# Altium project ESC_Controller.PrjPcb
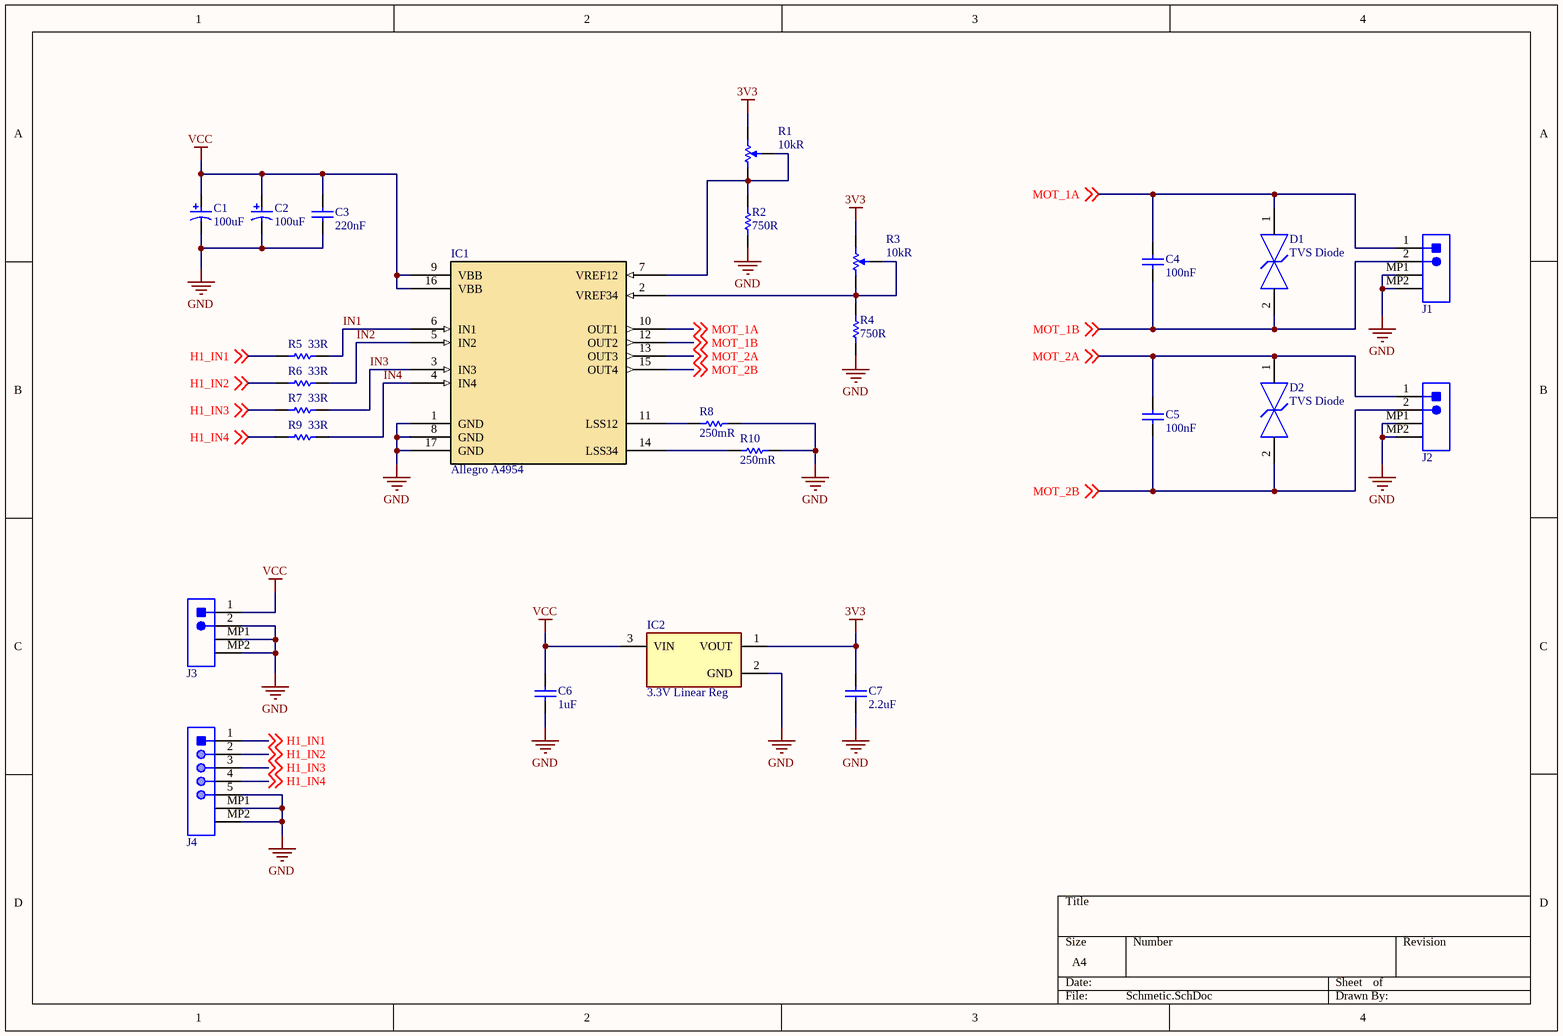
[diagram p0: Schmetic.SchDoc]
1 sheet, 25 parts. Net scope: global (net labels, ports and power ports of the same name join across sheets).
Board file: PCB.PcbDoc

## Sheet Schmetic.SchDoc
size A4

### Parts
C1  100uF  [NIC-UWT1H101MNL1GS_N]
C2  100uF  [NIC-UWT1H101MNL1GS_N]
C3  220nF  [CAPC1005X55N]
C4  100nF  [CAPC1005X60X30NL05T10]
C5  100nF  [CAPC1005X60X30NL05T10]
C6  1uF  [CAP_CL10_SAM]
C7  2.2uF  [CAPC1608X90N]
D1  TVS Diode  [FP-SMAJ-CA-MFG]
D2  TVS Diode  [FP-SMAJ-CA-MFG]
IC1  Allegro A4954  [TSSOP-16_ALM]
IC2  3.3V Linear Reg  [FP-SOT89-MFG]
J1  2 Pin Header  [JST-BM02B-GHS-TBT_V]  (value not drawn)
J2  2 Pin Header  [JST-BM02B-GHS-TBT_V]  (value not drawn)
J3  2 Pin Header  [JST-BM02B-GHS-TBT_V]  (value not drawn)
J4  5 Pin Header  [JST-BM05B-GHS-TBT_V]  (value not drawn)
R1  10kR  [BOUR-TC33X-2_V]
R2  750R  [RESC1005X40X25NL05T05]
R3  10kR  [BOUR-TC33X-2_V]
R4  750R  [RESC1005X40X25NL05T05]
R5  33R  [RESC1005X40X25NL05T05]
R6  33R  [RESC1005X40X25NL05T05]
R7  33R  [RESC1005X40X25NL05T05]
R8  250mR  [RESC3015X65N]
R9  33R  [RESC1005X40X25NL05T05]
R10  250mR  [RESC3015X65N]

### Nets
3V3: C7.2 IC2.1(VOUT) R1.3 R3.3
GND: C1.2 C2.2 C3.1 C6.1 C7.1 IC1.1(GND) IC1.8(GND) IC1.17(GND) IC2.2(GND) J1.MP1 J1.MP2 J2.MP1 J2.MP2 J3.2 J3.MP1 J3.MP2 J4.5 J4.MP1 J4.MP2 R2.1 R4.1 R8.2 R10.2
VCC: C1.1 C2.1 C3.2 C6.2 IC1.9(VBB) IC1.16(VBB) IC2.3(VIN) J3.1
H1_IN1: J4.1 R5.1 ; off-sheet H1_IN1
H1_IN2: J4.2 R6.1 ; off-sheet H1_IN2
H1_IN3: J4.3 R7.1 ; off-sheet H1_IN3
H1_IN4: J4.4 R9.1 ; off-sheet H1_IN4
IN1: IC1.6(IN1) R5.2
IN2: IC1.5(IN2) R6.2
IN3: IC1.3(IN3) R7.2
IN4: IC1.4(IN4) R9.2
MOT_1A: C4.2 D1.1 IC1.10(OUT1) J1.1 ; off-sheet MOT_1A
MOT_1B: C4.1 D1.2 IC1.12(OUT2) J1.2 ; off-sheet MOT_1B
MOT_2A: C5.1 D2.1 IC1.13(OUT3) J2.1 ; off-sheet MOT_2A
MOT_2B: C5.2 D2.2 IC1.15(OUT4) J2.2 ; off-sheet MOT_2B
NetIC1_2: IC1.2(VREF34) R3.1 R3.2 R4.2
NetIC1_7: IC1.7(VREF12) R1.1 R1.2 R2.2
NetIC1_11: IC1.11(LSS12) R8.1
NetIC1_14: IC1.14(LSS34) R10.1

### Library data of the parts
C1 C2 = 100uF: 100uF 50 V dc Aluminium Electrolytic Capacitor; WT Series 1000h 8 (Dia.) x 10mm; Manufacturer: Nichicon; Manufacturer Part Number: UWT1H101MNL1GS; Tolerance: 20%; Ripple Current: 140mA; Voltage Rating: 50V; Leakage Current: 3uA; Life (Hours): 1000Hour; Dissipation Factor: 0.14%; Supplier 1: Digi-Key; RoHS: Yes; Category: Aluminum Electrolytic Capacitors; Stock 1: 103638; Pricing 1: 1=0,44000, 10=0,31400, 50=0,23720, 100=0,20660 (USD); Mount: Surface Mount; Case/Package: Radial; Number of Pins: 2; Dielectric Material: Aluminium; Min Operating Temperature: -55°C; Max Operating Temperature: 105°C; Capacitance: 100uF; Package Quantity: 500; Packaging: Tape and Reel; Ripple Current (AC): 140mA; Voltage Rating (DC): 50V; Termination: SMD/SMT; Voltage: 50V; Diameter: 8mm; Length: 10mm; Height: 10mm; Height - Seated (Max): 0.413inch; Radiation Hardening: No; REACH SVHC: No SVHC; Lead Free: Lead Free; ComponentLink1URL: https://datasheet.ciiva.com/97/e-wt-97104.pdf?src-supplier=Digi-Key; ComponentLink1Description: https://datasheet.ciiva.com/97/e-wt-97104.pdf?src-supplier=Digi-Key; ComponentLink2URL: https://datasheet.ciiva.com/97/e-wt-97105.pdf?src-supplier=Digi-Key; ComponentLink2Description: https://datasheet.ciiva.com/97/e-wt-97105.pdf?src-supplier=Digi-Key; ComponentLink3URL: https://datasheet.ciiva.com/97/e-wt-97106.pdf?src-supplier=Digi-Key; ComponentLink3Description: https://datasheet.ciiva.com/97/e-wt-97106.pdf?src-supplier=Digi-Key; ComponentLink4URL: https://datasheet.ciiva.com/11776/0900766b80fa3a91-11776930.pdf?src-supplier=RSComponents; ComponentLink4Description: https://datasheet.ciiva.com/11776/0900766b80fa3a91-11776930.pdf?src-supplier=RSComponents; ComponentLink5URL: https://datasheet.ciiva.com/5362/e-wt-30307-5362773.pdf?src-supplier=Mouser; ComponentLink5Description: https://datasheet.ciiva.com/5362/e-wt-30307-5362773.pdf?src-supplier=Mouser; ComponentLink6URL: https://datasheet.ciiva.com/11686/e-wt-11686889.pdf?src-supplier=Avnet; ComponentLink6Description: https://datasheet.ciiva.com/11686/e-wt-11686889.pdf?src-supplier=Avnet; ComponentLink7URL: https://datasheet.ciiva.com/28458/1910938-28458459.pdf?src-supplier=Element14; ComponentLink7Description: https://datasheet.ciiva.com/28458/1910938-28458459.pdf?src-supplier=Element14; ComponentLink8URL: https://datasheet.ciiva.com/16502/e-wt-16502940.pdf?src-supplier=Future+Electronics; ComponentLink8Description: https://datasheet.ciiva.com/16502/e-wt-16502940.pdf?src-supplier=Future+Electronics; ComponentLink9URL: https://datasheet.ciiva.com/7781/e-wt-7781807.pdf?src-supplier=Element14; ComponentLink9Description: https://datasheet.ciiva.com/7781/e-wt-7781807.pdf?src-supplier=Element14; ComponentLink10URL: https://datasheet.ciiva.com/17527/e-wt-17527183.pdf?src-supplier=Avnet+Europe; ComponentLink10Description: https://datasheet.ciiva.com/17527/e-wt-17527183.pdf?src-supplier=Avnet+Europe; Supplier Part Number 1: 493-2226-1-ND
C3 = 220nF: TAIYO YUDEN - UMK105BJ224KV-F - CAPACITOR, MLCC, X5R, 0.22UF, 50V, 0402, FULL REEL; Tolerance: 10%; Supplier 1: Digi-Key; Manufacturer: Taiyo Yuden; Manufacturer Part Number: UMK105BJ224KV-F; RoHS: Yes; Category: Ceramic Capacitors; Stock 1: 285982; Pricing 1: 1=0,21000, 10=0,14400, 50=0,08660, 100=0,07320, 500=0,05006, 1000=0,04428, 2500=0,04235, 5000=0,03850 (USD); Mount: Surface Mount; Case/Package: 0402; Case Code (Metric): 1005; Case Code (Imperial): 0402; Min Operating Temperature: -55°C; Max Operating Temperature: 85°C; Termination: SMD/SMT; Package Quantity: 10000; Packaging: Tape and Reel; Capacitance: 220nF; Voltage Rating: 50V; Voltage Rating (DC): 50V; Dielectric: X5R; Length: 0.039inch; Height: 0.5mm; Thickness: 0.022inch; Width: 0.02inch; Lead Free: Lead Free; Halogen Free: Halogen Free; ComponentLink1URL: https://datasheet.ciiva.com/30112/713umk105bj224kv-f-30112478.pdf?src-supplier=Onlinecomponents.com; ComponentLink1Description: https://datasheet.ciiva.com/30112/713umk105bj224kv-f-30112478.pdf?src-supplier=Onlinecomponents.com; ComponentLink2URL: https://datasheet.ciiva.com/24495/460umk105bj224kv-f-24495779.pdf?src-supplier=Onlinecomponents.com; ComponentLink2Description: https://datasheet.ciiva.com/24495/460umk105bj224kv-f-24495779.pdf?src-supplier=Onlinecomponents.com; ComponentLink3URL: https://datasheet.ciiva.com/18697/mlcc-all-e-18697509.pdf?src-supplier=Digi-Key; ComponentLink3Description: https://datasheet.ciiva.com/18697/mlcc-all-e-18697509.pdf?src-supplier=Digi-Key; Supplier Part Number 1: 587-3500-1-ND
C4 C5 = 100nF: Capacitor 100 nF 10 VDC 0402 | KEMET C0402C104K8PACTU (Capacitor 100 nF 10 VDC 0402 Ceramic Capacitors).; Tolerance: 10%; Voltage Rating: 10V; Dielectric: X5R; Dissipation Factor: 5%; Supplier 1: Digi-Key; Manufacturer: KEMET; Manufacturer Part Number: C0402C104K8PACTU; RoHS: Yes; Category: Ceramic Capacitors; Stock 1: 907324; Pricing 1: 1=0,10000, 10=0,04000, 50=0,02180, 100=0,01780, 500=0,01270, 1000=0,00998, 2500=0,00908, 5000=0,00835 (USD); Mount: Surface Mount,PCB; Case/Package: 0402; Number of Pins: 2; Case Code (Metric): 1005; Case Code (Imperial): 0402; Contact Plating: Tin,Matte; Dielectric Material: Ceramic; Min Operating Temperature: -55°C; Max Operating Temperature: 85°C; Capacitance: 100nF; Voltage Rating (DC): 10V; Package Quantity: 1; Packaging: Tape and Reel; Termination: SMD/SMT; Voltage: 10V; Length: 1mm; Height: 0.5mm; Width: 0.02inch; Thickness: 0.022inch; Lead Pitch: 0.3mm; Depth: 0.5mm; Radiation Hardening: No; REACH SVHC: No SVHC; Lead Free: Lead Free; ComponentLink1URL: https://datasheet.ciiva.com/7747/1776086-7747440.pdf?src-supplier=Element14; ComponentLink1Description: https://datasheet.ciiva.com/7747/1776086-7747440.pdf?src-supplier=Element14; ComponentLink2URL: https://datasheet.ciiva.com/144/docfinderpartnumber-c0402c104k8pactu-144097.pdf?src-supplier=Digi-Key; ComponentLink2Description: https://datasheet.ciiva.com/144/docfinderpartnumber-c0402c104k8pactu-144097.pdf?src-supplier=Digi-Key; ComponentLink3URL: https://datasheet.ciiva.com/14595/70095383-14595064.pdf?src-supplier=Allied+Electronics; ComponentLink3Description: https://datasheet.ciiva.com/14595/70095383-14595064.pdf?src-supplier=Allied+Electronics; ComponentLink4URL: https://datasheet.ciiva.com/14588/70095383-14588187.pdf?src-supplier=Allied+Electronics; ComponentLink4Description: https://datasheet.ciiva.com/14588/70095383-14588187.pdf?src-supplier=Allied+Electronics; ComponentLink5URL: https://datasheet.ciiva.com/28645/1789732-28645387.pdf?src-supplier=Element14; ComponentLink5Description: https://datasheet.ciiva.com/28645/1789732-28645387.pdf?src-supplier=Element14; Supplier Part Number 1: 399-3027-1-ND
C6 = 1uF: Cap Ceramic 1uF 50V X5R 10% SMD 0603 85C Cardboard T/R; Manufacturer: Samsung; Manufacturer Part Number: CL10A105KB8NNNC; Supplier 1: Digi-Key; RoHS: Yes; Category: Ceramic Capacitors; Stock 1: 1724919; Pricing 1: 1=0,15000, 10=0,10500, 50=0,05960, 100=0,04940, 500=0,03462, 1000=0,02866 (USD); Mount: Surface Mount; Case/Package: 0603; Case Code (Imperial): 0603; Case Code (Metric): 1608; Contact Plating: Tin; Min Operating Temperature: -55°C; Max Operating Temperature: 85°C; Package Quantity: 1; Packaging: Tape and Reel; Capacitance: 1uF; Tolerance: 10%; Voltage Rating: 50V; Dielectric: X5R; Termination: Wraparound; Length: 1.6mm; Width: 0.031inch; Thickness: 0.035inch; Depth: 0.8mm; Radiation Hardening: No; ComponentLink1URL: https://datasheet.ciiva.com/26877/getdatasheetpartid-753736-26877879.pdf?src-supplier=Verical; ComponentLink1Description: https://datasheet.ciiva.com/26877/getdatasheetpartid-753736-26877879.pdf?src-supplier=Verical; Supplier Part Number 1: 1276-1860-1-ND
C7 = 2.2uF: SAMSUNG ELECTRO-MECHANICS - CL10A225KP8NNNC - SMD Multilayer Ceramic Capacitor, 2.2 µF, 10 V, 0603 [1608 Metric], ± 10%, X5R, CL Series; Voltage Rating: 10V; Supplier 1: Digi-Key; Manufacturer: Samsung; Manufacturer Part Number: CL10A225KP8NNNC; RoHS: Yes; Category: Ceramic Capacitors; Stock 1: 840059; Pricing 1: 1=0,10000, 10=0,05600, 50=0,03040, 100=0,02490, 500=0,01778, 1000=0,01398 (USD); Mount: Surface Mount; Case/Package: 0603; Case Code (Metric): 1608; Case Code (Imperial): 0603; Material: Ceramic; Min Operating Temperature: -55°C; Max Operating Temperature: 85°C; Tolerance: 10%; Capacitance: 2.2uF; Dielectric: X5R; Package Quantity: 1; Packaging: Tape and Reel; Voltage: 10V; Voltage Rating (DC): 10V; Length: 1.6mm; Height: 0.8mm; Width: 0.031inch; Thickness: 0.035inch; Depth: 0.8mm; Radiation Hardening: No; Lead Free: Lead Free; ComponentLink1URL: https://datasheet.ciiva.com/25799/cl10a225kp8nnnc-25799697.pdf?src-supplier=Digi-Key; ComponentLink1Description: https://datasheet.ciiva.com/25799/cl10a225kp8nnnc-25799697.pdf?src-supplier=Digi-Key; ComponentLink2URL: https://datasheet.ciiva.com/26838/getdatasheetpartid-358617-26838359.pdf?src-supplier=Verical; ComponentLink2Description: https://datasheet.ciiva.com/26838/getdatasheetpartid-358617-26838359.pdf?src-supplier=Verical; ComponentLink3URL: https://datasheet.ciiva.com/29198/457945-da-01-en-vs-kondensator-0603-29198592.pdf?src-supplier=Conrad; ComponentLink3Description: https://datasheet.ciiva.com/29198/457945-da-01-en-vs-kondensator-0603-29198592.pdf?src-supplier=Conrad; Supplier Part Number 1: 1276-1085-1-ND
D1 D2 = TVS Diode: LITTELFUSE - SMAJ36CA - TVS Diode, SMAJ Series, Bidirectional, 36 V, 58.1 V, DO-214AC (SMA), 2 Pins; Reverse Standoff Voltage: 36V; Clamping Voltage: 58.1V; Peak Pulse Current: 6.9A; Peak Pulse Power: 400W; Test Current: 1mA; Reverse Breakdown Voltage: 40V; Number of Elements: 1; Leakage Current: 1uA; Max Power Dissipation: 3.3W; Power Line Protection: No; Max Breakdown Voltage: 44.2V; Supplier 1: Digi-Key; Manufacturer: Littelfuse; Manufacturer Part Number: SMAJ36CA; RoHS: Yes; Category: TVS Diodes; Stock 1: 7566; Pricing 1: 1=0,41000, 10=0,27500, 100=0,15750, 500=0,11000, 1000=0,08750, 2000=0,08500 (USD); Mount: Surface Mount; Number of Pins: 2; Min Operating Temperature: -55°C; Max Operating Temperature: 150°C; Packaging: Tape and Reel; Polarity: Bidirectional; Breakdown Voltage: 40V; Package Quantity: 5000; Min Breakdown Voltage: 40V; Max Surge Current: 6.9A; Direction: Bidirectional; Operating Supply Voltage: 36V; Number of Channels: 1; Number of Bidirectional Channels: 1; Termination: SMD/SMT; Resistor Type: Zener; Voltage Rating (DC): 36V; Power Dissipation: 400W; Length: 5.28mm; Height: 2.29mm; Width: 2.79mm; REACH SVHC: No SVHC; Lead Free: Lead Free; ComponentLink1URL: https://datasheet.ciiva.com/331/littelfuse-tvs-diode-smaj-datasheet-pdf-331060.pdf?src-supplier=Digi-Key; ComponentLink1Description: https://datasheet.ciiva.com/331/littelfuse-tvs-diode-smaj-datasheet-pdf-331060.pdf?src-supplier=Digi-Key; ComponentLink2URL: https://datasheet.ciiva.com/331/littelfuse-tvs-diode-smaj-datasheet-pdf-331061.pdf?src-supplier=Digi-Key; ComponentLink2Description: https://datasheet.ciiva.com/331/littelfuse-tvs-diode-smaj-datasheet-pdf-331061.pdf?src-supplier=Digi-Key; ComponentLink3URL: https://datasheet.ciiva.com/331/littelfuse-tvs-diode-smaj-datasheet-pdf-331062.pdf?src-supplier=Digi-Key; ComponentLink3Description: https://datasheet.ciiva.com/331/littelfuse-tvs-diode-smaj-datasheet-pdf-331062.pdf?src-supplier=Digi-Key; ComponentLink4URL: https://datasheet.ciiva.com/16487/littelfuse-tvs-diode-smaj-16487439.pdf?src-supplier=Future+Electronics; ComponentLink4Description: https://datasheet.ciiva.com/16487/littelfuse-tvs-diode-smaj-16487439.pdf?src-supplier=Future+Electronics; Supplier Part Number 1: SMAJ36CALFCT-ND
IC1 = Allegro A4954: IC MOTOR DRIVER PAR 16TSSOP; Manufacturer: Allegro MicroSystems; Manufacturer Part Number: A4954ELPTR-T; Min Supply Voltage: 8V; Max Supply Voltage: 40V; Number of Outputs: 2; Output Current: 1.5A; Supplier 1: Digi-Key; RoHS: Yes; Category: Motor Drivers; Stock 1: 14132; Pricing 1: 1=2,76000, 10=2,47500, 25=2,34000, 100=1,92400, 250=1,72640, 500=1,66400, 1000=1,38320 (USD); Mount: Surface Mount; Case/Package: TSSOP; Min Operating Temperature: -40°C; Max Operating Temperature: 85°C; Packaging: Tape and Reel; Package Quantity: 1; Lead Free: Lead Free; ComponentLink1URL: https://datasheet.ciiva.com/8199/a4954-datasheet-8199653.pdf?src-supplier=Avnet; ComponentLink1Description: https://datasheet.ciiva.com/8199/a4954-datasheet-8199653.pdf?src-supplier=Avnet; ComponentLink2URL: https://datasheet.ciiva.com/17233/a4954-datasheet-17233770.pdf?src-supplier=Avnet+Europe; ComponentLink2Description: https://datasheet.ciiva.com/17233/a4954-datasheet-17233770.pdf?src-supplier=Avnet+Europe; Supplier Part Number 1: 620-1384-1-ND
IC2 = 3.3V Linear Reg: IC REG LINEAR 3.3V 150MA SOT89; Manufacturer: Diodes; Manufacturer Part Number: AP7381-33Y-13; Output Type: Fixed; Output Configuration: Positive; Number of Regulators: 1; Max Input Voltage: 40V; Dropout Voltage: 1V; Quiescent Current: 2.5uA; Max Supply Current: 25uA; Supplier 1: Mouser; RoHS: No; Category: Voltage Regulators - Linear; Stock 1: 86570; Pricing 1: 1=0,44000, 10=0,29700, 100=0,14100, 1000=0,10800, 2500=0,09100, 10000=0,08300 (USD); Mount: Surface Mount; Case/Package: SOT-89; Min Operating Temperature: -40°C; Max Operating Temperature: 125°C; Packaging: Tape and Reel; Min Output Voltage: 3.3V; Output Current: 150mA; ComponentLink1URL: https://www.diodes.com/assets/Datasheets/AP7381.pdf?src-supplier=Digi-Key; ComponentLink1Description: https://www.diodes.com/assets/Datasheets/AP7381.pdf?src-supplier=Digi-Key; Supplier Part Number 1: 621-AP7381-33Y-13
J1-J3 = 2 Pin Header: CONN HEADER SMD 2POS 1.25MM; Manufacturer: JST; Manufacturer Part Number: BM02B-GHS-TBT(LF)(SN)(N); Number of Positions: 2; Connector Type: Outer Shroud Contact; Pitch: 0.049inch; Supplier 1: Digi-Key; RoHS: Yes; Category: Connectors; Stock 1: 188; Pricing 1: 1=0,39000, 10=0,36800, 100=0,25760, 500=0,22076, 1000=0,18397 (USD); Mount: Surface Mount; Contact Plating: Tin; Color: Natural; Packaging: Tape and Reel; Number of Rows: 1; Termination: Solder; Fastening Type: Ramp; Lead Free: Lead Free; ComponentLink1URL: http://www.jst-mfg.com/product/pdf/eng/eGH.pdf?src-supplier=Digi-Key; ComponentLink1Description: http://www.jst-mfg.com/product/pdf/eng/eGH.pdf?src-supplier=Digi-Key; Supplier Part Number 1: 455-1578-1-ND
R1 R3 = 10kR: Res Trimmer 10K Ohm 25% 1/10W 1(Elec)/1(Mech)Turn (3 X 3.8mm) Foot Print SMD Embossed T/R; Manufacturer: Bourns; Manufacturer Part Number: TC33X-2-103E; Power Rating: 100mW; Temperature Coefficient: 250ppm/°C; Number of Turns: 1; Voltage Rating (DC): 50V; Supplier 1: Digi-Key; RoHS: Yes; Category: Variable Resistors and Potentiometers; Stock 1: 123264; Pricing 1: 1=0,26000, 10=0,25200, 25=0,22760, 50=0,21700, 100=0,21000, 250=0,19600, 500=0,17850, 1000=0,16100 (USD); Mount: Surface Mount; Weight: 29.4mg; Color: Silver; Contact Plating: Copper,Tin,Silver; Min Operating Temperature: -40°C; Max Operating Temperature: 100°C; Tolerance: 25%; Resistance: 10kR; Packaging: Tape and Reel; Package Quantity: 2500; Resistor Type: Cermet,Potentiometer; Termination: Foot Print; Max Power Dissipation: 100mW; Taper: Linear; Length: 3mm; Height: 0.047inch; Width: 0.118inch; Depth: 3.8mm; Radiation Hardening: No; Military Standard: Not; REACH SVHC: No SVHC; Lead Free: Lead Free; ComponentLink1URL: https://datasheet.ciiva.com/11830/0900766b802749b3-11830705.pdf?src-supplier=RSComponents; ComponentLink1Description: https://datasheet.ciiva.com/11830/0900766b802749b3-11830705.pdf?src-supplier=RSComponents; ComponentLink2URL: https://datasheet.ciiva.com/7953/1818686-7953349.pdf?src-supplier=Element14; ComponentLink2Description: https://datasheet.ciiva.com/7953/1818686-7953349.pdf?src-supplier=Element14; ComponentLink3URL: https://datasheet.ciiva.com/26944/getdatasheetpartid-183773-26944166.pdf?src-supplier=Verical; ComponentLink3Description: https://datasheet.ciiva.com/26944/getdatasheetpartid-183773-26944166.pdf?src-supplier=Verical; ComponentLink4URL: https://datasheet.ciiva.com/2155/tc33-2155962.pdf?src-supplier=Digi-Key; ComponentLink4Description: https://datasheet.ciiva.com/2155/tc33-2155962.pdf?src-supplier=Digi-Key; ComponentLink5URL: https://datasheet.ciiva.com/2155/tc33-2155963.pdf?src-supplier=Digi-Key; ComponentLink5Description: https://datasheet.ciiva.com/2155/tc33-2155963.pdf?src-supplier=Digi-Key; ComponentLink6URL: https://datasheet.ciiva.com/2155/tc33-2155964.pdf?src-supplier=Digi-Key; ComponentLink6Description: https://datasheet.ciiva.com/2155/tc33-2155964.pdf?src-supplier=Digi-Key; ComponentLink7URL: https://datasheet.ciiva.com/8089/tc33-8089484.pdf?src-supplier=Avnet; ComponentLink7Description: https://datasheet.ciiva.com/8089/tc33-8089484.pdf?src-supplier=Avnet; ComponentLink8URL: https://datasheet.ciiva.com/28659/1520225-28659212.pdf?src-supplier=Element14; ComponentLink8Description: https://datasheet.ciiva.com/28659/1520225-28659212.pdf?src-supplier=Element14; ComponentLink9URL: https://datasheet.ciiva.com/16802/tc33-16802397.pdf?src-supplier=Avnet+Europe; ComponentLink9Description: https://datasheet.ciiva.com/16802/tc33-16802397.pdf?src-supplier=Avnet+Europe; Supplier Part Number 1: TC33X-103ECT-ND
R2 R4 = 750R: PANASONIC - ERJ2RKF7500X - SMD Chip Resistor, 0402 [1005 Metric], 750 ohm, ERJ2RK Series, 50 V, Thick Film, 100 mW; Power Rating: 100mW; Tolerance: 1%; Voltage Rating: 50V; Temperature Coefficient: 100ppm/°C; Supplier 1: Digi-Key; Manufacturer: Panasonic; Manufacturer Part Number: ERJ2RKF7500X; RoHS: Yes; Category: Chip SMD Resistors; Stock 1: 397750; Pricing 1: 1=0,10000, 10=0,02200, 100=0,00890, 1000=0,00398, 2500=0,00345, 5000=0,00285 (USD); Mount: Surface Mount; Case/Package: 0402; Case Code (Metric): 1005; Case Code (Imperial): 0402; Contact Plating: Tin; Min Operating Temperature: -55°C; Max Operating Temperature: 155°C; Resistance: 750R; Packaging: Tape and Reel; Resistor Type: Thick Film; Voltage Rating (DC): 50V; Package Quantity: 10000; Number of Terminations: 2; Termination: SMD/SMT; Max Power Dissipation: 100mW; Features: Automotive AEC-Q200; Length: 1mm; Height: 0.35mm; Depth: 0.5mm; Width: 0.02inch; REACH SVHC: No SVHC; Military Standard: Not; Lead Free: Lead Free; ComponentLink1URL: https://datasheet.ciiva.com/9180/aoa0000ce2-9180085.pdf?src-supplier=Avnet; ComponentLink1Description: https://datasheet.ciiva.com/9180/aoa0000ce2-9180085.pdf?src-supplier=Avnet; ComponentLink2URL: https://datasheet.ciiva.com/28676/1678782-28676646.pdf?src-supplier=Element14; ComponentLink2Description: https://datasheet.ciiva.com/28676/1678782-28676646.pdf?src-supplier=Element14; ComponentLink3URL: https://datasheet.ciiva.com/28565/1678782-28565079.pdf?src-supplier=Element14; ComponentLink3Description: https://datasheet.ciiva.com/28565/1678782-28565079.pdf?src-supplier=Element14; ComponentLink4URL: https://datasheet.ciiva.com/30202/aoa0000ce2-30202551.pdf?src-supplier=Onlinecomponents.com; ComponentLink4Description: https://datasheet.ciiva.com/30202/aoa0000ce2-30202551.pdf?src-supplier=Onlinecomponents.com; Supplier Part Number 1: P750LCT-ND
R5-R7 R9 = 33R: GLOVE, POLYAMIDE, L/FREE, PU, SIZE 6 - More Details; Manufacturer: Panasonic; Manufacturer Part Number: ERJ-2GEJ330X; Tolerance: 5%; Power Rating: 100mW; Voltage Rating: 50V; Temperature Coefficient: 200ppm/°C; Supplier 1: Digi-Key; RoHS: Yes; Category: Chip SMD Resistors; Stock 1: 1309957; Pricing 1: 1=0,10000, 10=0,01900, 100=0,00770, 1000=0,00345, 2500=0,00299, 5000=0,00247 (USD); Mount: Surface Mount; Case/Package: 0402; Case Code (Metric): 1005; Case Code (Imperial): 0402; Contact Plating: Tin; Min Operating Temperature: -55°C; Max Operating Temperature: 155°C; Resistance: 33R; Packaging: Tape and Reel; Resistor Type: Thick Film; Package Quantity: 1; Number of Terminations: 2; Termination: SMD/SMT; Max Power Dissipation: 100mW; Voltage Rating (DC): 50V; Features: Automotive AEC-Q200; Length: 1mm; Height: 0.35mm; Depth: 0.5mm; Width: 0.02inch; Radiation Hardening: No; REACH SVHC: No SVHC; Military Standard: Not; Lead Free: Lead Free; ComponentLink1URL: https://datasheet.ciiva.com/39121/1986916-39121637.pdf?src-supplier=Jameco; ComponentLink1Description: https://datasheet.ciiva.com/39121/1986916-39121637.pdf?src-supplier=Jameco; ComponentLink2URL: https://datasheet.ciiva.com/11821/0900766b80f806dd-11821291.pdf?src-supplier=RSComponents; ComponentLink2Description: https://datasheet.ciiva.com/11821/0900766b80f806dd-11821291.pdf?src-supplier=RSComponents; ComponentLink3URL: https://datasheet.ciiva.com/43460/1500035-43460357.pdf?src-supplier=Farnell; ComponentLink3Description: https://datasheet.ciiva.com/43460/1500035-43460357.pdf?src-supplier=Farnell; ComponentLink4URL: https://datasheet.ciiva.com/46374/1500035-46374021.pdf?src-supplier=Element14; ComponentLink4Description: https://datasheet.ciiva.com/46374/1500035-46374021.pdf?src-supplier=Element14; ComponentLink5URL: https://datasheet.ciiva.com/16522/aoa0000ce1-16522983.pdf?src-supplier=Avnet+Asia; ComponentLink5Description: https://datasheet.ciiva.com/16522/aoa0000ce1-16522983.pdf?src-supplier=Avnet+Asia; ComponentLink6URL: https://datasheet.ciiva.com/9190/aoa0000ce1-9190504.pdf?src-supplier=Avnet; ComponentLink6Description: https://datasheet.ciiva.com/9190/aoa0000ce1-9190504.pdf?src-supplier=Avnet; ComponentLink7URL: https://datasheet.ciiva.com/16784/70260739-16784442.pdf?src-supplier=Allied+Electronics; ComponentLink7Description: https://datasheet.ciiva.com/16784/70260739-16784442.pdf?src-supplier=Allied+Electronics; ComponentLink8URL: https://datasheet.ciiva.com/16449/aoa0000ce1-16449547.pdf?src-supplier=Future+Electronics; ComponentLink8Description: https://datasheet.ciiva.com/16449/aoa0000ce1-16449547.pdf?src-supplier=Future+Electronics; ComponentLink9URL: https://datasheet.ciiva.com/30205/4aoa0000ce1-30205131.pdf?src-supplier=Onlinecomponents.com; ComponentLink9Description: https://datasheet.ciiva.com/30205/4aoa0000ce1-30205131.pdf?src-supplier=Onlinecomponents.com; ComponentLink10URL: https://datasheet.ciiva.com/46386/1500035-46386748.pdf?src-supplier=Element14; ComponentLink10Description: https://datasheet.ciiva.com/46386/1500035-46386748.pdf?src-supplier=Element14; ComponentLink11URL: https://datasheet.ciiva.com/28547/1678796-28547165.pdf?src-supplier=Element14; ComponentLink11Description: https://datasheet.ciiva.com/28547/1678796-28547165.pdf?src-supplier=Element14; ComponentLink12URL: https://datasheet.ciiva.com/28686/1678796-28686909.pdf?src-supplier=Element14; ComponentLink12Description: https://datasheet.ciiva.com/28686/1678796-28686909.pdf?src-supplier=Element14; ComponentLink13URL: https://datasheet.ciiva.com/48530/aoa0000ce1-48530957.pdf?src-supplier=Avnet; ComponentLink13Description: https://datasheet.ciiva.com/48530/aoa0000ce1-48530957.pdf?src-supplier=Avnet; ComponentLink14URL: https://datasheet.ciiva.com/5917/1500035-5917807.pdf?src-supplier=Farnell; ComponentLink14Description: https://datasheet.ciiva.com/5917/1500035-5917807.pdf?src-supplier=Farnell; Supplier Part Number 1: P33JCT-ND
R8 R10 = 250mR: Res Thick Film 1206 250m Ohm 1% 1/2W 100ppm/C Molded SMD Paper T/R; Manufacturer: Stackpole Electronics; Manufacturer Part Number: CSR1206FKR250; Max Power Dissipation: 500mW; Temperature Coefficient: 100ppm/°C; Supplier 1: Digi-Key; RoHS: Yes; Category: Chip SMD Resistors; Stock 1: 191422; Pricing 1: 1=0,41000, 10=0,31100, 25=0,23640, 50=0,17560, 100=0,13050, 250=0,11024, 500=0,09450 (USD); Mount: Surface Mount; Case/Package: 1206; Case Code (Imperial): 1206; Contact Plating: Tin,Matte; Case Code (Metric): 3216; Min Operating Temperature: -55°C; Max Operating Temperature: 155°C; Resistance: 250mR; Tolerance: 1%; Packaging: Tape and Reel; Power Rating: 500mW; Resistor Type: Thick Film; Termination: Wraparound; Number of Terminations: 2; Length: 0.12inch; Height: 0.026inch; Width: 0.061inch; Lead Free: Lead Free; ComponentLink1URL: https://www.seielect.com/catalog/SEI-CSR_CSRN.pdf?src-supplier=Avnet+Asia; ComponentLink1Description: https://www.seielect.com/catalog/SEI-CSR_CSRN.pdf?src-supplier=Avnet+Asia; ComponentLink2URL: https://www.seielect.com/catalog/SEI-Packaging.pdf?src-supplier=Digi-Key; ComponentLink2Description: https://www.seielect.com/catalog/SEI-Packaging.pdf?src-supplier=Digi-Key; Supplier Part Number 1: CSR1206FKR250CT-ND